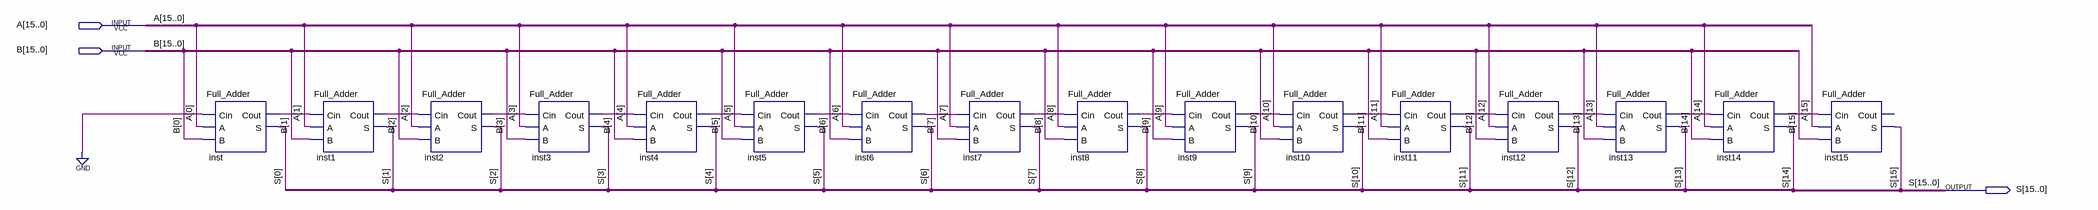
[diagram p0: schematic sheet]
// Quartus schematic ACongB_16bit.bdf as structural Verilog: 16 symbols, 3 pins
module ACongB_16bit (
  input  [15:0] A,
  input  [15:0] B,
  output [15:0] S
);

  wire inst1_cout, inst2_cout, inst3_cout, inst4_cout, inst5_cout, inst6_cout, inst7_cout, inst8_cout,
       inst9_cout, inst10_cout, inst11_cout, inst12_cout, inst13_cout, inst14_cout, inst_cout;

  Full_Adder inst (.Cin(1'b0), .A(A[0]), .B(B[0]), .Cout(inst_cout), .S(S[0]));
  Full_Adder inst1 (.Cin(inst_cout), .A(A[1]), .B(B[1]), .Cout(inst1_cout), .S(S[1]));
  Full_Adder inst2 (.Cin(inst1_cout), .A(A[2]), .B(B[2]), .Cout(inst2_cout), .S(S[2]));
  Full_Adder inst3 (.Cin(inst2_cout), .A(A[3]), .B(B[3]), .Cout(inst3_cout), .S(S[3]));
  Full_Adder inst4 (.Cin(inst3_cout), .A(A[4]), .B(B[4]), .Cout(inst4_cout), .S(S[4]));
  Full_Adder inst5 (.Cin(inst4_cout), .A(A[5]), .B(B[5]), .Cout(inst5_cout), .S(S[5]));
  Full_Adder inst6 (.Cin(inst5_cout), .A(A[6]), .B(B[6]), .Cout(inst6_cout), .S(S[6]));
  Full_Adder inst7 (.Cin(inst6_cout), .A(A[7]), .B(B[7]), .Cout(inst7_cout), .S(S[7]));
  Full_Adder inst8 (.Cin(inst7_cout), .A(A[8]), .B(B[8]), .Cout(inst8_cout), .S(S[8]));
  Full_Adder inst9 (.Cin(inst8_cout), .A(A[9]), .B(B[9]), .Cout(inst9_cout), .S(S[9]));
  Full_Adder inst10 (.Cin(inst9_cout), .A(A[10]), .B(B[10]), .Cout(inst10_cout), .S(S[10]));
  Full_Adder inst11 (.Cin(inst10_cout), .A(A[11]), .B(B[11]), .Cout(inst11_cout), .S(S[11]));
  Full_Adder inst12 (.Cin(inst11_cout), .A(A[12]), .B(B[12]), .Cout(inst12_cout), .S(S[12]));
  Full_Adder inst13 (.Cin(inst12_cout), .A(A[13]), .B(B[13]), .Cout(inst13_cout), .S(S[13]));
  Full_Adder inst14 (.Cin(inst13_cout), .A(A[14]), .B(B[14]), .Cout(inst14_cout), .S(S[14]));
  Full_Adder inst15 (.Cin(inst14_cout), .A(A[15]), .B(B[15]), .S(S[15]));  // open: Cout
endmodule
